# EAGLE design VinoTemp (EAGLE 7.3.0)
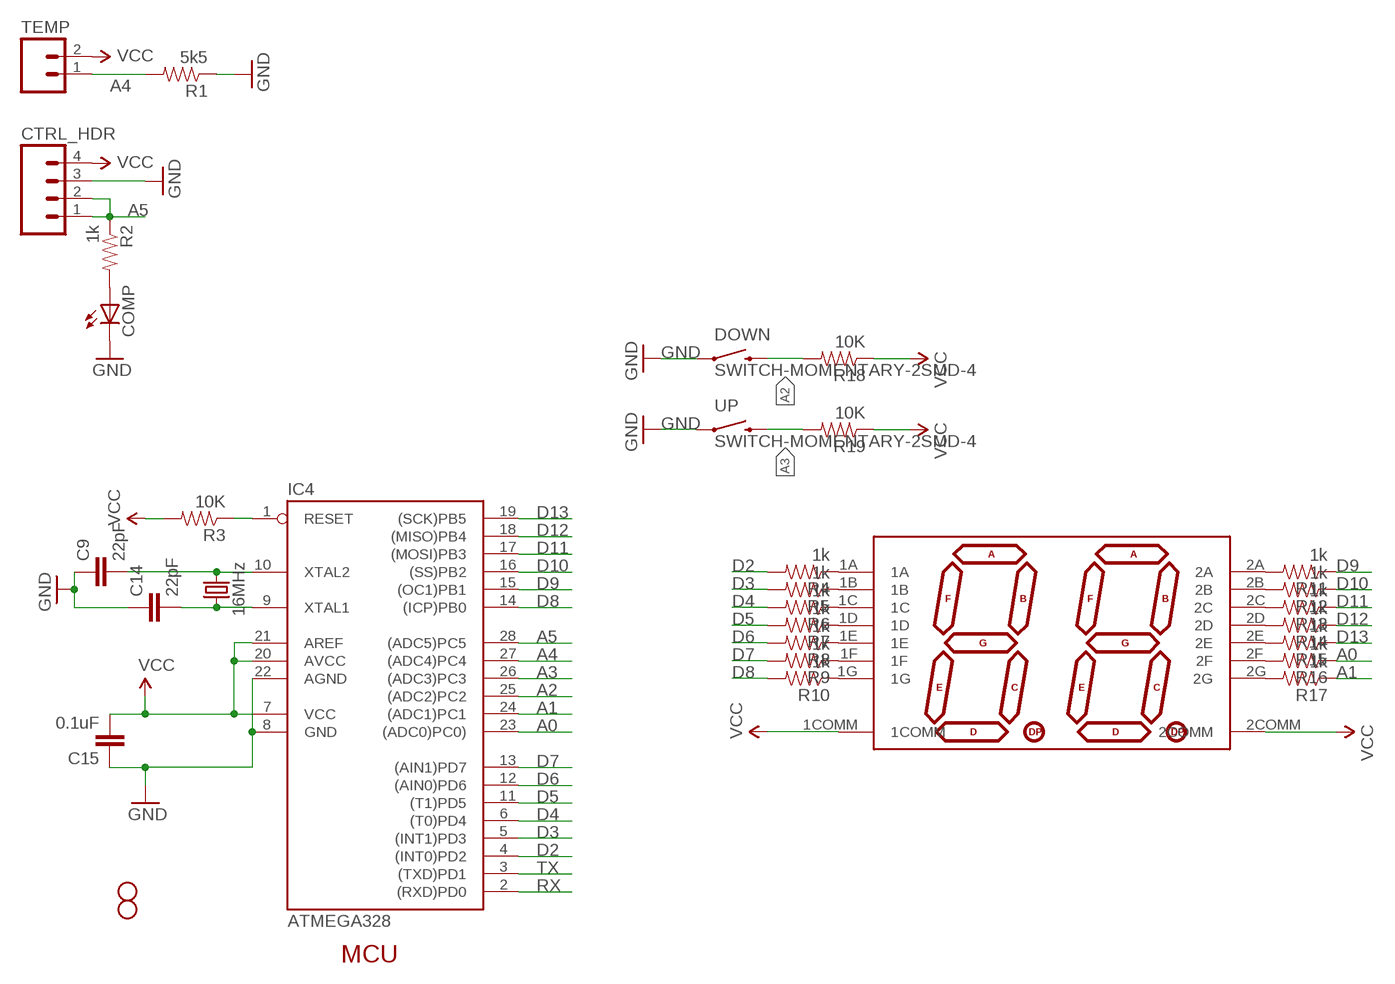
[diagram p0: schematic, sheet 1]

## Parts
C9  22pF  CAPPTH2  [CAP-PTH-SMALL2]
C14  22pF  CAPPTH2  [CAP-PTH-SMALL2]
C15  0.1uF  CAPPTH2  [CAP-PTH-SMALL2]
COMP  LED3MM  [LED3MM]
CTRL_HDR  M04POLAR  [MOLEX-1X4]
DOWN  SWITCH-MOMENTARY-2SMD-4  [TACTILE_SWITCH_TALL]
IC4  ATMEGA328  AT90S4433P  [DIL28-3]
JP2  STAND-OFF#2  [STAND-OFF-#2]
JP6  STAND-OFF#2  [STAND-OFF-#2]
R1  5k5  RESISTORAXIAL-0.3  [AXIAL-0.3]
R2  1k  RESISTOR0805-RES  [0805]
R3  10K  RESISTOR0805-RES  [0805]
R4  1k  RESISTOR0805-RES  [0805]
R5  1k  RESISTOR0805-RES  [0805]
R6  1k  RESISTOR0805-RES  [0805]
R7  1k  RESISTOR0805-RES  [0805]
R8  1k  RESISTOR0805-RES  [0805]
R9  1k  RESISTOR0805-RES  [0805]
R10  1k  RESISTOR0805-RES  [0805]
R11  1k  RESISTOR0805-RES  [0805]
R12  1k  RESISTOR0805-RES  [0805]
R13  1k  RESISTOR0805-RES  [0805]
R14  1k  RESISTOR0805-RES  [0805]
R15  1k  RESISTOR0805-RES  [0805]
R16  1k  RESISTOR0805-RES  [0805]
R17  1k  RESISTOR0805-RES  [0805]
R18  10K  RESISTOR0805-RES  [0805]
R19  10K  RESISTOR0805-RES  [0805]
TEMP  M02POLAR  [MOLEX-1X2]
U$1  7-SEGMENT-DISPLAY-2-DIGITPTH  [7-SEGMENT-DISPLAY-2-DIGIT-KINGBRIGHT-DA04]
UP  SWITCH-MOMENTARY-2SMD-4  [TACTILE_SWITCH_TALL]
Y1  16MHz  CRYSTALHC49US  [HC49US]

## Nets
A0: IC4.23((ADC0)PC0)) R16.1
A1: IC4.24((ADC1)PC1) R17.1
A2: DOWN.B2 IC4.25((ADC2)PC2) R18.2
A3: IC4.26((ADC3)PC3) R19.2 UP.B2
A4: IC4.27((ADC4)PC4) R1.P$2 TEMP.1
A5: CTRL_HDR.1 CTRL_HDR.2 IC4.28((ADC5)PC5) R2.1
D2: IC4.4((INT0)PD2) R4.2
D3: IC4.5((INT1)PD3) R5.2
D4: IC4.6((T0)PD4) R6.2
D5: IC4.11((T1)PD5) R7.2
D6: IC4.12((AIN0)PD6) R8.2
D7: IC4.13((AIN1)PD7) R9.2
D8: IC4.14((ICP)PB0) R10.2
D9: IC4.15((OC1)PB1) R11.1
D10: IC4.16((SS)PB2) R12.1
D11: IC4.17((MOSI)PB3) R13.1
D12: IC4.18((MISO)PB4) R14.1
D13: IC4.19((SCK)PB5) R15.1
GND [power]: C9.1 C14.1 C15.1 COMP.K(C) CTRL_HDR.3 DOWN.A2 IC4.8(GND) IC4.22(AGND) R1.P$1 UP.A2
N$1: COMP.A R2.2
N$2: R4.1 U$1.1A
N$3: R5.1 U$1.1B
N$4: R6.1 U$1.1C
N$5: R7.1 U$1.1D
N$6: R8.1 U$1.1E
N$7: R9.1 U$1.1F
N$8: R10.1 U$1.1G
N$9: R11.2 U$1.2A
N$10: R12.2 U$1.2B
N$11: R13.2 U$1.2C
N$12: R14.2 U$1.2D
N$13: R15.2 U$1.2E
N$14: R16.2 U$1.2F
N$15: R17.2 U$1.2G
RST: IC4.1(RESET) R3.1
RX: IC4.2((RXD)PD0)
TX: IC4.3((TXD)PD1)
VCC [power]: C15.2 CTRL_HDR.4 IC4.7(VCC) IC4.20(AVCC) IC4.21(AREF) R3.2 R18.1 R19.1 TEMP.2 U$1.1COMM U$1.2COMM
XTAL1: C14.2 IC4.9(XTAL1) Y1.1
XTAL2: C9.2 IC4.10(XTAL2) Y1.2

## Notes on the sheet
- MCU

## Library data of the parts
C9 C14 C15 = Dek:CAP: Capacitor Standard 0603 ceramic capacitor, and 0.1" leaded capacitor.
COMP = led:LED: LED OSRAM: - CHIPLED LG R971, LG N971, LY N971, LG Q971, LY Q971, LO R971, LY R971 LH N974, LH R974 LS Q976, LO Q976, LY Q976 LO Q996 - Hyper CHIPLED LW Q18S LB Q993, LB Q99A, LB R99A - SideLED LS A670, LO A670, LY A670, LG A670, LP A670 LB A673, LV A673, LT A673, LW A673 LH A674 LY A675 LS A676, LA A676, LO A676, LY A676, LW A676 LS A679, LY A679, LG A679 - Hyper Micro SIDELED® LS Y876, LA Y876, LO Y876, LY Y876 LT Y87S - SmartLED LW L88C, LW L88S LB L89C, LB L89S, LG L890 LS L89K, LO L89K, LY L89K LS L896, LA L896, LO L896, LY L896 - TOPLED LS T670, LO T670, LY T670, LG T670, LP T670 LSG T670, LSP T670, LSY T670, LOP T670, LYG T670 LG T671, LOG T671, LSG T671 LB T673, LV T673, LT T673, LW T673 LH T674 LS T676, LA T676, LO T676, LY T676, LB T676, LH T676, LSB T676, LW T676 LB T67C, LV T67C, LT T67C, LS T67K, LO T67K, LY T67K, LW E67C LS E67B, LA E67B, LO E67B, LY E67B, LB E67C, LV E67C, LT E67C LW T67C LS T679, LY T679, LG T679 LS T770, LO T770, LY T770, LG T770, LP T770 LB T773, LV T773, LT T773, LW T773 LH T774 LS E675, LA E675, LY E675, LS T675 LS T776, LA T776, LO T776, LY T776, LB T776 LHGB T686 LT T68C, LB T68C - Hyper Mini TOPLED® LB M676 - Mini TOPLED Santana® LG M470 LS M47K, LO M47K, LY M47K Source: http://www.osram.convergy.de LUXEON: - LUMILED® LXK2-PW12-R00, LXK2-PW12-S00, LXK2-PW14-U00, LXK2-PW14-V00 LXK2-PM12-R00, LXK2-PM12-S00, LXK2-PM14-U00 LXK2-PE12-Q00, LXK2-PE12-R00, LXK2-PE12-S00, LXK2-PE14-T00, LXK2-PE14-U00 LXK2-PB12-K00, LXK2-PB12-L00, LXK2-PB12-M00, LXK2-PB14-N00, LXK2-PB14-P00, LXK2-PB14-Q00 LXK2-PR12-L00, LXK2-PR12-M00, LXK2-PR14-Q00, LXK2-PR14-R00 LXK2-PD12-Q00, LXK2-PD12-R00, LXK2-PD12-S00 LXK2-PH12-R00, LXK2-PH12-S00 LXK2-PL12-P00, LXK2-PL12-Q00, LXK2-PL12-R00 Source: www.luxeon.com KINGBRIGHT: KA-3528ASYC Source: www.kingbright.com
CTRL_HDR = SparkFun-Connectors:M04: Header 4 Standard 4-pin 0.1" header. Use with straight break away headers (SKU : PRT-00116), right angle break away headers (PRT-00553), swiss pins (PRT-00743), machine pins (PRT-00117), and female headers (PRT-00115). Molex polarized connector foot print use with SKU : PRT-08231 with associated crimp pins and housings. 1MM SMD Version SKU: PRT-10208
DOWN UP = SparkFun-Electromechanical:SWITCH-MOMENTARY-2: Various NO switches- pushbuttons, reed, etc; PROD_ID: SWCH-11966
IC4 = Dek:AT90S4433: MICROCONTROLLER 4 Kbytes FLASH 128 bytes SRAM 256 bytes EEPROM UART 6-channel 10 bit ADC; OC_FARNELL: unknown; OC_NEWARK: unknown
JP2 JP6 = Dek:STAND-OFF: Stand Off This is the mechanical footprint for a #2 phillips button head screw. Use the keepout ring to avoid running the screw head into surrounding components.
R1 = Dek:RESISTOR: Resistor Basic schematic elements and footprints for 0603, 1206, and PTH resistors.
R2-R19 = SparkFun-Resistors:RESISTOR: Resistor Basic schematic elements and footprints for 0603, 1206, and PTH resistors.
TEMP = SparkFun-Connectors:M02: Standard 2-pin 0.1" header. Use with - straight break away headers ( PRT-00116) - right angle break away headers (PRT-00553) - swiss pins (PRT-00743) - machine pins (PRT-00117) - female headers (PRT-00115) Molex polarized connector foot print use with: PRT-08233 with associated crimp pins and housings. 2.54_SCREWTERM for use with PRT-10571. 3.5mm Screw Terminal footprints for PRT-08084 5mm Screw Terminal footprints for use with PRT-08432
U$1 = Dek:7-SEGMENT-DISPLAY-2-DIGIT
Y1 = Dek:CRYSTAL: Various standard crystals. Proven footprints. Spark Fun Electronics SKU : COM-00534

## Net classes
2 old_power: width 0.813 mm, clearance 0.508 mm

## Board
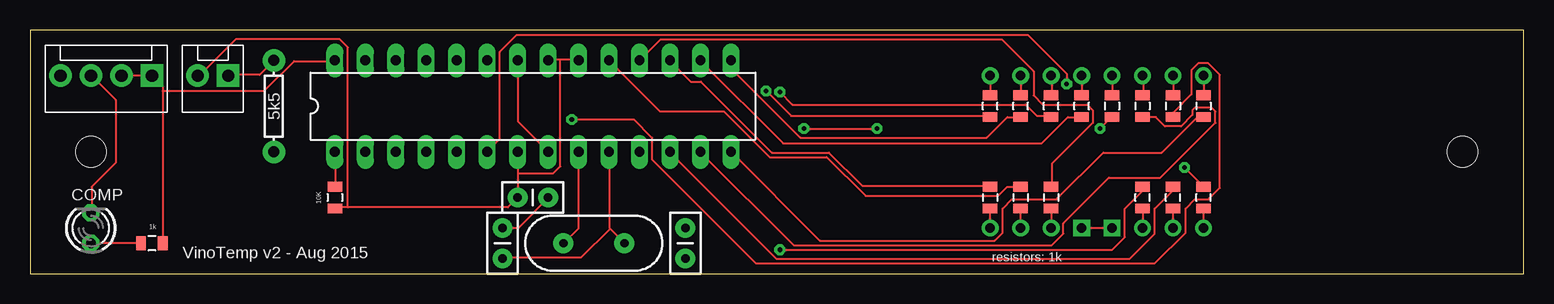
[diagram p1: board, top side]
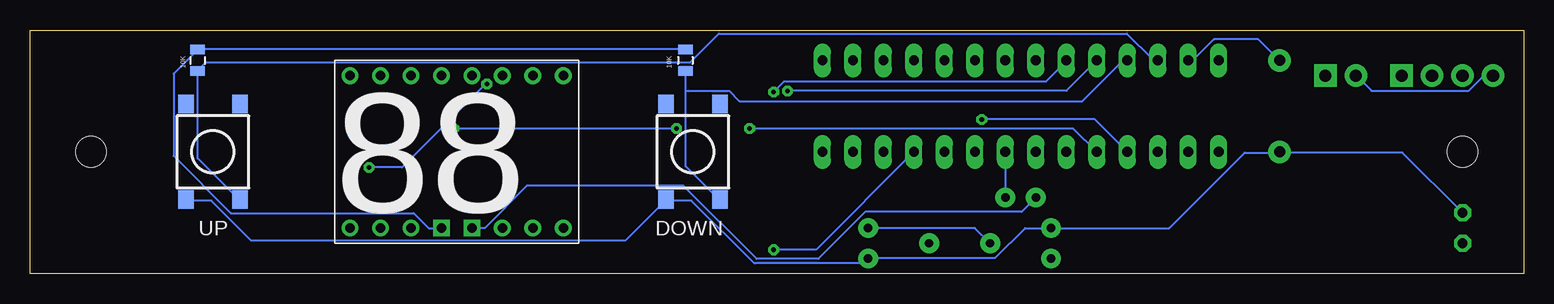
[diagram p2: board, bottom side, seen from below]

Size 124.46 x 20.31 mm. Coordinates in mm from the lower left corner, seen from the top.
Outline: 0,0 124.46,0 124.46,20.31 0,20.31 0,0
Copper layers (1*16): Top 0.035mm / dielectric 1.5mm / Bottom 0.035mm
Design rules "SparkFun-2-layer": minimum track width 7mil, minimum drill 15mil, track to track 8mil, track to pad 8mil, pad to pad 8mil, via to via 8mil, smd to smd 8mil, copper to edge 8mil, drill to drill 8mil, minimum pad ring 12mil, minimum via ring 10mil, stop-mask expansion 4mil, vias tented up to drill 20mil, thermal gap 10mil

### Footprints (pad centres in the part's own frame; a part is rotated, then mirrored left to right if it is on the bottom)
CAP-PTH-SMALL2 = drill 0.7 pad 1.651: 1 0,0; 2 2.54,0
LED3MM = drill 0.813 octagon: A -1.27,0; K 1.27,0
MOLEX-1X4 = drill 1.016 pad 1.88 square: 1 0,0 | drill 1.016 pad 1.88: 2 2.54,0; 3 5.08,0; 4 7.62,0
TACTILE_SWITCH_TALL = smd 1.55 x 1.3: A1 -3.975,-2.25; A2 3.975,-2.25; B1 -3.975,2.25; B2 3.975,2.25
DIL28-3 = drill 0.813 long: 1 -16.51,-3.81; 2 -13.97,-3.81; 3 -11.43,-3.81; 4 -8.89,-3.81; 5 -6.35,-3.81; 6 -3.81,-3.81; 7 -1.27,-3.81; 8 1.27,-3.81; 9 3.81,-3.81; 10 6.35,-3.81; 11 8.89,-3.81; 12 11.43,-3.81; 13 13.97,-3.81; 14 16.51,-3.81; 15 16.51,3.81; 16 13.97,3.81; 17 11.43,3.81; 18 8.89,3.81; 19 6.35,3.81; 20 3.81,3.81; 21 1.27,3.81; 22 -1.27,3.81; 23 -3.81,3.81; 24 -6.35,3.81; 25 -8.89,3.81; 26 -11.43,3.81; 27 -13.97,3.81; 28 -16.51,3.81
STAND-OFF-#2 = hole 2.54: 0,0
AXIAL-0.3 = drill 0.9 pad 1.88: P$1 -3.81,0; P$2 3.81,0
0805 = smd 0.8 x 1.2: 1 -0.9,0; 2 0.9,0
MOLEX-1X2 = drill 1.016 pad 1.88 square: 1 0,0 | drill 1.016 pad 1.88: 2 2.54,0
7-SEGMENT-DISPLAY-2-DIGIT-KINGBRIGHT-DA04 = drill 0.8: 1A -6.35,6.35; 1B -1.27,6.35; 1C -8.89,-6.35; 1D -3.81,-6.35; 1E -6.35,-6.35; 1F -3.81,6.35; 1G -8.89,6.35; 2A 6.35,6.35; 2B 1.27,6.35; 2C 8.89,-6.35; 2D 3.81,-6.35; 2E 6.35,-6.35; 2F 3.81,6.35; 2G 8.89,6.35 | drill 0.8 square: 1COMM -1.27,-6.35; 2COMM 1.27,-6.35
HC49US = drill 0.7 pad 1.651: 1 -2.54,0; 2 2.54,0

### Placement (x,y rotation side)
C9  39.37,3.81 270 top
C14  54.61,1.27 90 top
C15  43.18,6.35 180 top
COMP  5.08,3.81 90 top
CTRL_HDR  10.16,16.51 180 top
DOWN  69.22,10.16 270 bottom
IC4  41.91,13.97 0 top
JP2  5.08,10.16 0 top
JP6  119.38,10.16 0 top
R1  20.32,13.97 90 top
R2  10.16,2.54 180 top
R3  25.4,6.35 270 top
R4  95.25,13.97 270 top
R5  90.17,13.97 270 top
R6  97.79,6.35 90 top
R7  92.71,6.35 90 top
R8  95.25,6.35 90 top
R9  92.71,13.97 270 top
R10  97.79,13.97 270 top
R11  82.55,13.97 90 top
R12  87.63,13.97 90 top
R13  80.01,6.35 270 top
R14  85.09,6.35 270 top
R15  82.55,6.35 270 top
R16  85.09,13.97 90 top
R17  80.01,13.97 90 top
R18  69.85,17.78 270 bottom
R19  110.49,17.78 270 bottom
TEMP  16.51,16.51 180 top
U$1  88.9,10.16 0 bottom
UP  109.22,10.16 270 bottom
Y1  46.99,2.54 0 top

### Tracks (layer width: path | path; a pad name or v marks a point on that pad's centre or on a via)
A0  (via drill 0.38)
  Top 0.178: v62.48,15.14 63.53,14.1 82.96,14.1 83.92,13.14 85.06,13.14 R16.1
  Bottom 0.178: v62.48,15.14 61.63,16 39.81,16 38.1,17.72 IC4.23
A1  (via drill 0.38)
  Top 0.178: v61.34,15.24 63.44,13.14 80.01,13.14 R17.1
  Bottom 0.178: v61.34,15.24 38.1,15.24 IC4.24
A2
  Bottom 0.178: 69.82,15.24 69.82,8.95 67.06,6.19 DOWN.B2 | 69.82,15.24 69.82,16.86 R18.2 | 69.82,15.24 66.2,15.24 65.34,14.38 36.77,14.38 33.43,17.72 33.05,17.72 IC4.25
A3
  Bottom 0.178: UP.B2 107.06,6.19 110.49,9.62 R19.2 110.49,16.95 109.82,17.62 69.44,17.62 67.06,20 33.05,20 30.86,17.81 30.48,17.81 IC4.26
A4
  Top 0.178: TEMP.1 16.57,16.57 19.14,16.57 20.29,17.72 R1.P$2
  Bottom 0.178: IC4.27 27.91,17.81 27.53,17.81 25.81,19.53 22.1,19.53 20.38,17.81 R1.P$2
A5
  Top 0.178: 11.05,15.24 11.05,15.62 CTRL_HDR.1 10.1,16.48 7.62,16.48 CTRL_HDR.2 | 11.05,15.24 11.05,2.57 R2.1 | 11.05,15.24 19.53,15.24 22,17.72 25.34,17.72 IC4.28
D2  (via drill 0.38)
  Top 0.178: R4.2 95.25,13.43 96.77,14.95 96.77,16.95 97.35,17.53 98.2,17.53 99.16,16.57 99.16,7.14 98.2,6.19 97.06,6.19 96.3,5.43 96.3,3.43 93.73,0.86 60.48,0.86 51.82,9.53 51.82,11.34 50.29,12.86 v45.15,12.86
  Bottom 0.178: v45.15,12.86 35.72,12.86 IC4.4
D3  (via drill 0.38)
  Top 0.178: v89.15,12.1 90.11,13.05 R5.2 | v64.48,12.1 v70.58,12.1
  Bottom 0.178: v70.58,12.1 v89.15,12.1 | v64.48,12.1 37.53,12.1 35.62,10.19 IC4.5
D4  (via drill 0.38)
  Top 0.178: v96.2,8.86 97.73,7.33 R6.2 | v86.39,15.81 86.39,16.67 83.15,19.91 40.58,19.91 39.15,18.48 39.15,11.24 38.1,10.19 IC4.6
  Bottom 0.178: v96.2,8.86 93.44,8.86 86.49,15.81 v86.39,15.81
D5  (via drill 0.38)
  Top 0.178: v62.48,2 90.2,2 91.25,3.05 91.25,5.43 92.68,6.86 92.68,7.24 R7.2
  Bottom 0.178: v62.48,2 58.96,2 IC4.11
D6
  Top 0.178: R8.2 95.25,6.95 93.73,5.43 93.73,3.33 91.63,1.24 62.2,1.24 53.34,10.1 IC4.12
D7
  Top 0.178: R9.2 92.77,13.05 93.82,13.05 94.58,12.29 95.92,12.29 96.87,13.24 96.87,13.62 97.06,13.81 98.49,13.81 98.77,13.53 98.77,12.57 94.2,8 89.92,8 86.11,4.19 86.11,3.33 85.15,2.38 63.63,2.38 55.91,10.1 IC4.13
D8
  Top 0.178: IC4.14 65.82,2.76 80.39,2.76 81.06,3.43 81.06,5.43 81.82,6.19 85.53,6.19 89.44,10.1 94.3,10.1 97.25,13.05 97.73,13.05 R10.2
D9
  Top 0.178: R11.1 82.49,13.05 81.44,13.05 79.72,11.34 64.2,11.34 58.48,17.05 58.48,17.72 IC4.15
D10
  Top 0.178: R12.1 87.63,13.05 86.49,13.05 84.3,10.86 62.77,10.86 55.91,17.72 IC4.16
D11
  Top 0.178: R13.1 80.01,7.33 69.34,7.33 66.58,10.1 61.82,10.1 55.91,16 55.05,16 53.34,17.72 IC4.17
D12
  Top 0.178: R14.1 85.15,7.33 85.15,9.14 88.58,12.57 88.58,13.62 88.11,14.1 84.39,14.1 83.63,14.86 83.63,16.86 80.96,19.53 52.58,19.53 50.86,17.81 IC4.18
D13
  Top 0.178: R15.1 82.49,7.24 81.44,7.24 80.68,6.48 69.63,6.48 66.39,9.72 61.63,9.72 57.82,13.53 52.48,13.53 48.29,17.72 IC4.19
GND
  Top 0.178: COMP.K 5.14,5.14 5.14,7.24 7.14,9.24 7.14,14.48 5.14,16.48 CTRL_HDR.3 | IC4.8 40.67,12.67 40.67,17.72 IC4.22 | C9.1 40.67,3.81 43.15,6.29 C15.1
  Bottom 0.178: COMP.K 10.1,10.1 20.29,10.1 R1.P$1 20.38,10.1 23.24,10.1 29.53,3.81 C9.1 41.53,3.81 44.01,1.33 54.58,1.33 C14.1 54.67,1.24 55.05,0.86 64.1,0.86 69.34,6.1 71.44,6.1 DOWN.A2 71.53,6.1 74.87,2.76 106.01,2.76 109.35,6.1 111.44,6.1 UP.A2 | IC4.8 43.15,10.1 43.15,6.38 C15.1
N$1
  Top 0.178: R2.2 9.24,2.57 5.14,2.57 COMP.A
N$2
  Top 0.178: U$1.1A R4.1
N$3
  Top 0.178: R5.1 90.2,14.95 90.2,16.48 U$1.1B
N$4
  Top 0.178: R6.1 97.82,5.43 97.82,3.81 U$1.1C
N$5
  Top 0.178: R7.1 92.77,5.43 92.77,3.81 U$1.1D
N$6
  Top 0.178: U$1.1E R8.1
N$7
  Top 0.178: R9.1 92.77,14.95 92.77,16.48 U$1.1F
N$8
  Top 0.178: R10.1 97.82,14.95 97.82,16.48 U$1.1G
N$9
  Top 0.178: R11.2 82.58,14.95 82.58,16.48 U$1.2A
N$10
  Top 0.178: U$1.2B R12.2
N$11
  Top 0.178: U$1.2C R13.2
N$12
  Top 0.178: R14.2 85.15,5.43 85.15,3.81 U$1.2D
N$13
  Top 0.178: R15.2 82.58,5.43 82.58,3.81 U$1.2E
N$14
  Top 0.178: R16.2 85.15,14.95 85.15,16.48 U$1.2F
N$15
  Top 0.178: U$1.2G R17.2
RST
  Top 0.178: R3.1 25.43,7.33 25.43,10.1 IC4.1
VCC
  Top 0.178: U$1.1COMM U$1.2COMM | 44.2,17.81 45.72,17.81 IC4.20 | 44.2,17.81 43.24,17.81 IC4.21 | 26.48,5.52 39.81,5.52 C15.2 40.67,6.38 40.67,8.38 | 26.48,5.52 25.43,5.52 R3.2 | 40.67,8.38 40.67,10.1 IC4.7 | 44.2,17.81 44.2,8.95 43.62,8.38 40.67,8.38 | 26.48,5.52 26.48,18.86 25.81,19.53 17.14,19.53 14.19,16.57 14,16.57 TEMP.2
  Bottom 0.178: R18.1 69.91,18.76 110.49,18.76 R19.1 112.49,16.67 112.49,9.81 107.73,5.05 92.49,5.05 91.25,3.81 U$1.1COMM | CTRL_HDR.4 2.57,16.48 3.33,16.48 4.57,15.24 12.67,15.24 13.91,16.48 TEMP.2 | U$1.2COMM 86.58,3.81 83.06,7.33 70.01,7.33 63.91,1.24 58.77,1.24 54.86,5.14 41.81,5.14 40.67,6.29 C15.2
XTAL1
  Top 0.178: IC4.9 45.72,3.81 Y1.1
  Bottom 0.178: C14.2 45.72,3.81 Y1.1
XTAL2
  Top 0.178: 48.34,3.76 49.53,2.57 Y1.2 | 48.34,3.76 48.29,3.81 48.29,10.1 IC4.10 | 48.34,3.76 45.91,1.33 39.43,1.33 C9.2

### Text on the board
tNames: VinoTemp v2 - Aug 2015 | resistors: 1k